# EAGLE schematic RC_simple (EAGLE 9.6.2)
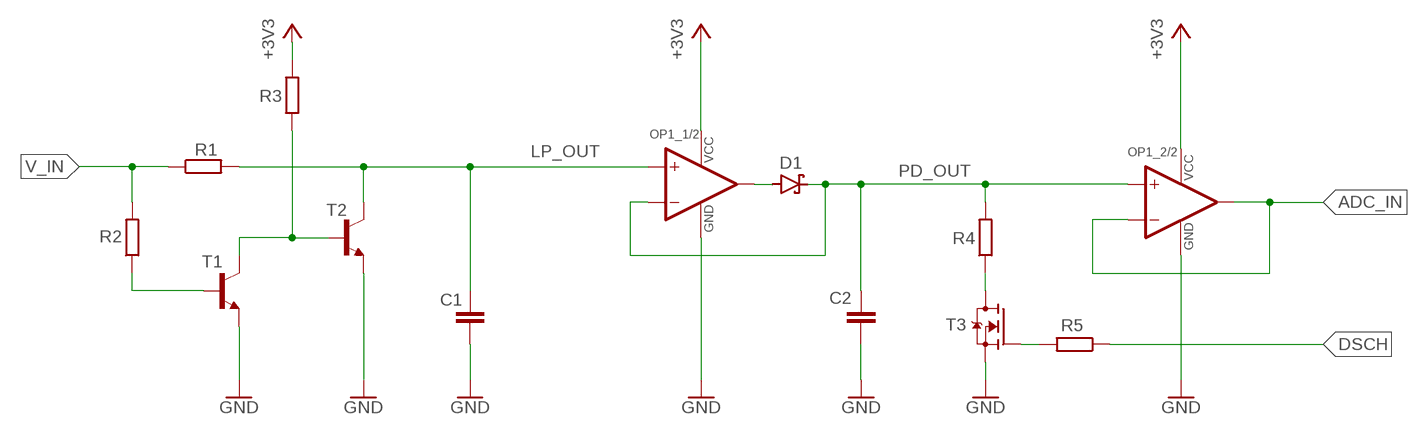
[diagram p0: schematic, sheet 1]

## Parts
C1  CAP_CERAMIC_0603  [SMD_0603C]
C2  CAP_CERAMIC_0603  [SMD_0603C]
D1  BAT54  [SOT23]
OP1  MAX_OP_AMPUMAX  [SOT23-8]
OP2  MAX_OP_AMPUMAX  [SOT23-8]
R1  RESISTOR_0603  [SMD_0603]
R2  RESISTOR_0603  [SMD_0603]
R3  RESISTOR_0603  [SMD_0603]
R4  RESISTOR_0603  [SMD_0603]
R5  RESISTOR_0603  [SMD_0603]
T1  BC847  [SOT23]
T2  BC847  [SOT23]
T3  BSS138  [SOT-23-3]

## Nets
+3V3: OP1.P$8(V+) OP2.P$8(V+) R3.2
ADC_IN: OP1.P$6(_2/2:-IN) OP1.P$7(_2/2:OUT)
DSCH: R5.1
GND/2: C1.2 C2.2 OP1.P$4(V-) OP2.P$4(V-) T1.2(E) T2.2(E) T3.2(S) ; supply symbol labelled GND
LP_OUT: C1.1 OP1.P$3(_1/2:+IN) R1.2 T2.3(C)
N$1: R2.1 T1.1(B)
N$2: R4.1 T3.3(D)
N$3: D1.1(A) OP1.P$1(_1/2:OUT)
N$4: R3.1 T1.3(C) T2.1(B)
N$5: R5.2 T3.1(G)
PD_OUT: C2.1 D1.3(C) OP1.P$2(_1/2:-IN) OP1.P$5(_2/2:+IN) R4.2
V_IN: R1.1 R2.2
Unconnected: OP2.P$1(_1/2:OUT) OP2.P$2(_1/2:-IN) OP2.P$3(_1/2:+IN) OP2.P$5(_2/2:+IN) OP2.P$6(_2/2:-IN) OP2.P$7(_2/2:OUT)

## Library data of the parts
C1 C2 = SIG_Parts:CAP_CERAMIC_*
D1 = diode:BAT54: Schottky Diodes Source: Fairchild .. BAT54.pdf
OP1 OP2 = SIG_Parts:MAX_OP_AMP
R1-R5 = SIG_Parts:RESISTOR_*
T1 T2 = transistor:BC847: NPN TRANSISTOR
T3 = SIG_Parts:BSS138